# EAGLE design Rotary Encoder Breakout (EAGLE 9.6.2)
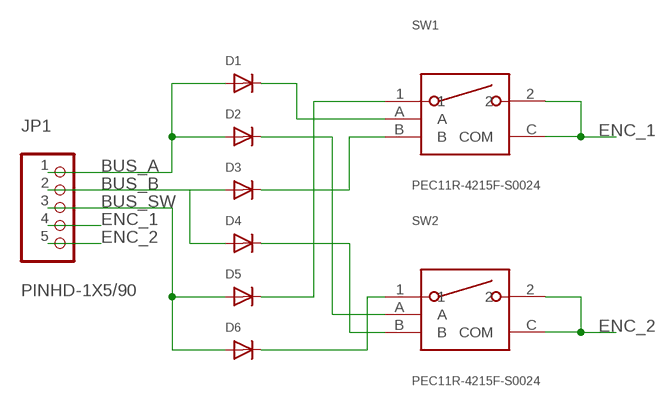
[diagram p0: schematic, sheet 1]

## Parts
D1  DIODESOD-123  [SOD-123]
D2  DIODESOD-123  [SOD-123]
D3  DIODESOD-123  [SOD-123]
D4  DIODESOD-123  [SOD-123]
D5  DIODESOD-123  [SOD-123]
D6  DIODESOD-123  [SOD-123]
JP1  PINHD-1X5/90  [1X05/90]
SW1  PEC11R-4215F-S0024  [PEC11R-4215F-S0024]
SW2  PEC11R-4215F-S0024  [PEC11R-4215F-S0024]

## Nets
BUS_A: D1.A D2.A JP1.1
BUS_B: D3.A D4.A JP1.2
BUS_SW: D5.A D6.A JP1.3
ENC_1: JP1.4 SW1.2 SW1.C(COM)
ENC_2: JP1.5 SW2.2 SW2.C(COM)
N$1: D1.C SW1.A
N$2: D2.C SW2.A
N$3: D3.C SW1.B
N$4: D4.C SW2.B
N$5: D5.C SW1.1
N$6: D6.C SW2.1

## Library data of the parts
D1-D6 = adafruit:DIODE: Diode SMADIODE - SMA Surface Mount Package 20V 1A Schottky Diode Digikey: 641-1014-6-ND DO-1N4148 - Through Hole Small Current Diode SOD-123 20V 1 A (.5mV Vf) Schottky Diode - Digikey: MBRX120TPMSCT-ND SOD-323 10V 570mA (.38mV Vf, 3ns) Schottky Diode - Digikey: ZLLS410CT-ND SOD-523 30V 30mA Schottky Diode (RB751S-40TE61) - Digikey: RB751S-40TE61CT-ND SOT23-R/W - SOT23 Package (R = Solder Paste/Reflow Ovens, W = Hand-Soldering) BAT54Film 40V 300mA - Digikey: 497-7162-1-ND
JP1 = Connector:PINHD-1X5: PIN HEADER; CATEGORY: CONNECTOR; SUB-CATEGORY: PIN-HEADER
SW1 SW2 = Switch:PEC11R-4215F-S0024: ROTARY ENCODER MECHANICAL 24PPR Manufacturer's datasheet <https://www.bourns.com/docs/Product-Datasheets/PEC11R.pdf>; CREATED_BY: PCBLayout.com; DIGIKEY_PART_NUMBER: PEC11R-4215F-S0024-ND; MANUFACTURER: Bourns Inc.; MPN: PEC11R-4215F-S0024

## Board
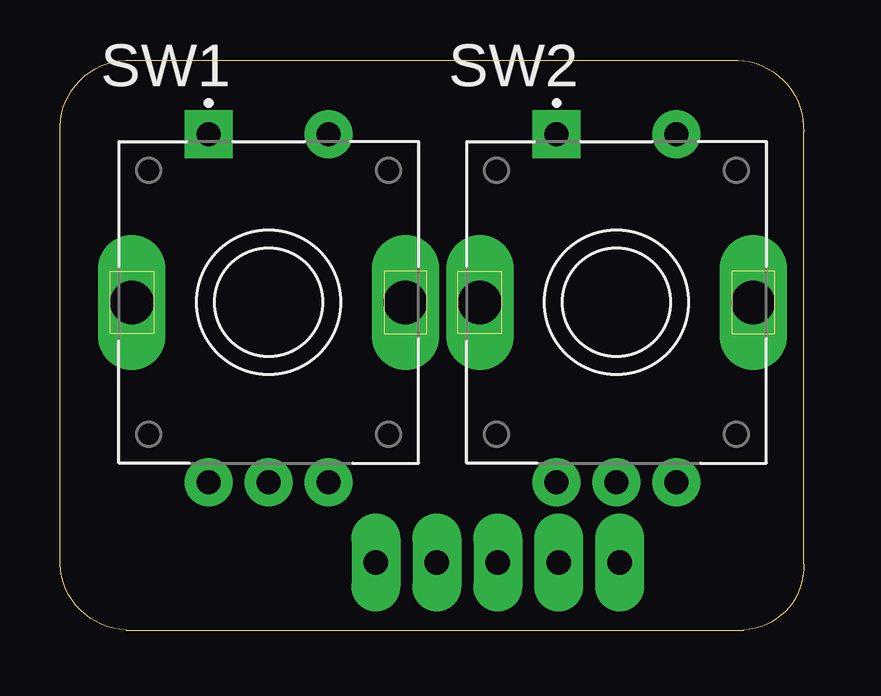
[diagram p1: board, top side]
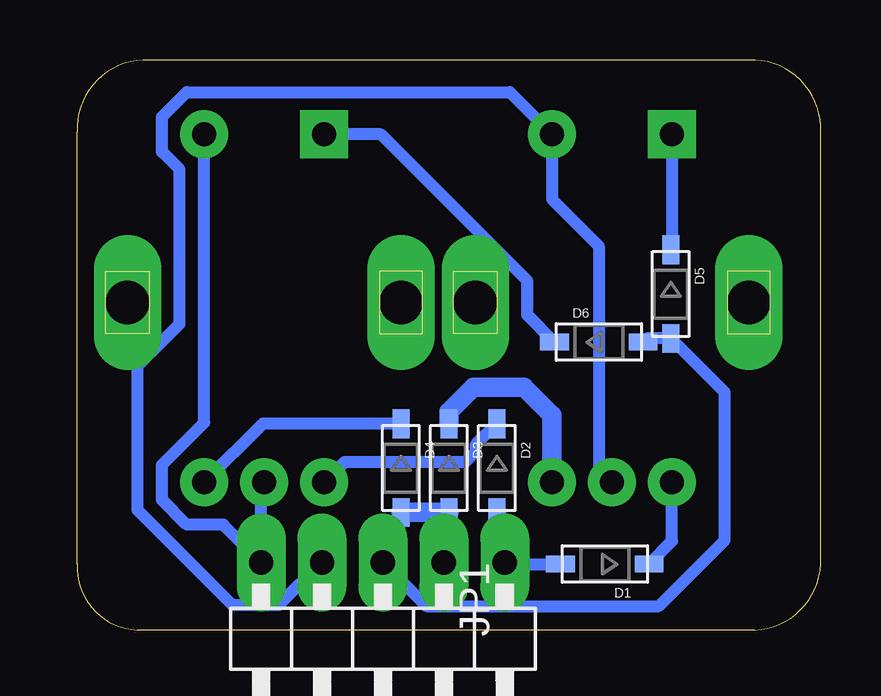
[diagram p2: board, bottom side, seen from below]

Size 31 x 23.75 mm. Coordinates in mm from the lower left corner, seen from the top.
Outline: 2.75,0 28.5,0 arc90 31,2.75 31,20.75 arc90 28.25,23.75 3,23.75 arc90 0,21 0,3 arc90 2.75,0
Copper layers (1*16): Top 0.035mm / dielectric 1.5mm / Bottom 0.035mm
Design rules "swidzi_milling_3018_tht_test": minimum track width 20mil, minimum drill 0.8mm, track to track 20mil, track to pad 20mil, pad to pad 20mil, via to via 6mil, smd to smd 6mil, copper to edge 15mil, drill to drill 6mil, minimum pad ring 10mil, minimum via ring 8mil, stop-mask expansion 4mil, vias tented up to drill 0mil, thermal gap 10mil

### Footprints (pad centres in the part's own frame; a part is rotated, then mirrored left to right if it is on the bottom)
SOD-123 = smd 1.2 x 0.7: A 1.85,0; C -1.85,0
1X05/90 = drill 1.016 long: 1 -5.08,-3.81; 2 -2.54,-3.81; 3 0,-3.81; 4 2.54,-3.81; 5 5.08,-3.81
PEC11R-4215F-S0024 = drill 1 square: 1 -2.5,7 | drill 1: 2 2.5,7; A -2.5,-7.5; B 2.5,-7.5; C 0,-7.5 | drill 1.8 long: P1 -5.7,0; P2 5.7,0

### Placement (x,y rotation side)
D1  9,2.75 180 bottom
D2  13.5,6.75 270 bottom
D3  15.5,6.75 270 bottom
D4  17.5,6.75 270 bottom
D5  6.25,14 270 bottom
D6  9.25,12 0 bottom
JP1  18.25,-1 180 bottom
SW1  8.7,13.65 0 top
SW2  23.2,13.65 0 top

### Tracks (layer width: path | path; a pad name or v marks a point on that pad's centre or on a via)
BUS_A
  Bottom 0.508: D1.A 13.11,2.75 JP1.1 13.17,4.57 D2.A
BUS_B
  Bottom 0.508: JP1.2 15.71,4.69 D3.A
  Bottom 0.813: D4.A D3.A
BUS_SW
  Bottom 0.508: JP1.3 16.44,1 6.75,1 4,3.75 4,9.9 D5.A 7.25,12.15 D6.A
ENC_1
  Bottom 0.508: JP1.4 20.82,2.81 22.59,1.03 24.51,1.03 28.48,5 28.48,11 26.73,12.75 26.73,19.19 27.46,19.92 27.46,21.38 26.43,22.41 12.96,22.41 SW1.2 11.2,17.95 9.25,16 9.25,6.7 SW1.C
ENC_2
  Bottom 0.508: SW2.C 23.33,6.02 JP1.5 24.91,4.39 26.43,4.39 27.46,5.42 27.46,6.88 25.7,8.64 SW2.2
N$1
  Bottom 0.508: D1.C 6.2,3.7 SW1.A
N$2
  Bottom 0.508: D2.C 14.39,7.71 14.39,7.43 14.83,6.99 17.92,6.99 17.93,7 19.85,7 SW2.A
N$3
  Bottom 0.813: D3.C 15.5,9.09 14.48,10.11 12.36,10.11 11.2,8.95 SW1.B
N$4
  Bottom 0.508: D4.C 23.25,8.6 SW2.B
N$5
  Bottom 0.508: SW1.1 6.2,15.9 D5.C
N$6
  Bottom 0.508: D6.C 12.23,13.13 12.23,14.55 18.33,20.65 SW2.1